# EAGLE design buses (EAGLE 9.6.2)
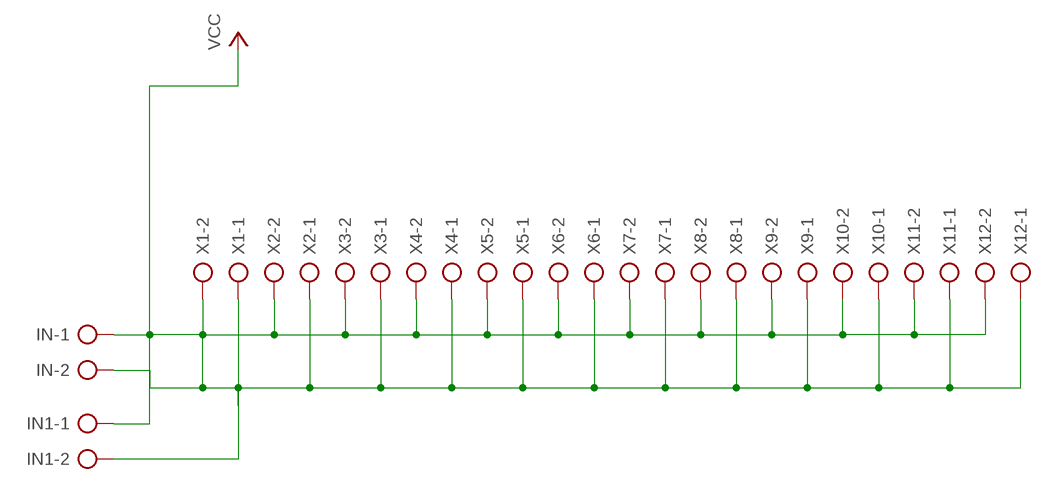
[diagram p0: schematic, sheet 1]

## Parts
IN  AK500/2-H  [AK500/2-H]
IN1  AK500/2-H  [AK500/2-H]
X1  AK500/2-H  [AK500/2-H]
X2  AK500/2-H  [AK500/2-H]
X3  AK500/2-H  [AK500/2-H]
X4  AK500/2-H  [AK500/2-H]
X5  AK500/2-H  [AK500/2-H]
X6  AK500/2-H  [AK500/2-H]
X7  AK500/2-H  [AK500/2-H]
X8  AK500/2-H  [AK500/2-H]
X9  AK500/2-H  [AK500/2-H]
X10  AK500/2-H  [AK500/2-H]
X11  AK500/2-H  [AK500/2-H]
X12  AK500/2-H  [AK500/2-H]

## Nets
VCC: IN1.1 IN1.2 IN.1 IN.2 X1.1 X1.2 X2.1 X2.2 X3.1 X3.2 X4.1 X4.2 X5.1 X5.2 X6.1 X6.2 X7.1 X7.2 X8.1 X8.2 X9.1 X9.2 X10.1 X10.2 X11.1 X11.2 X12.1 X12.2

## Library data of the parts
IN IN1 X1-X12 = con-ptr500:AK500/2-H: CONNECTOR Aug. 2004 / PTR Meßtechnik: Die Bezeichnung der Serie AK505 wurde geändert. Es handelt sich hierbei um AK500 in horizontaler Ausführung.; OC_FARNELL: unknown; OC_NEWARK: unknown

## Board
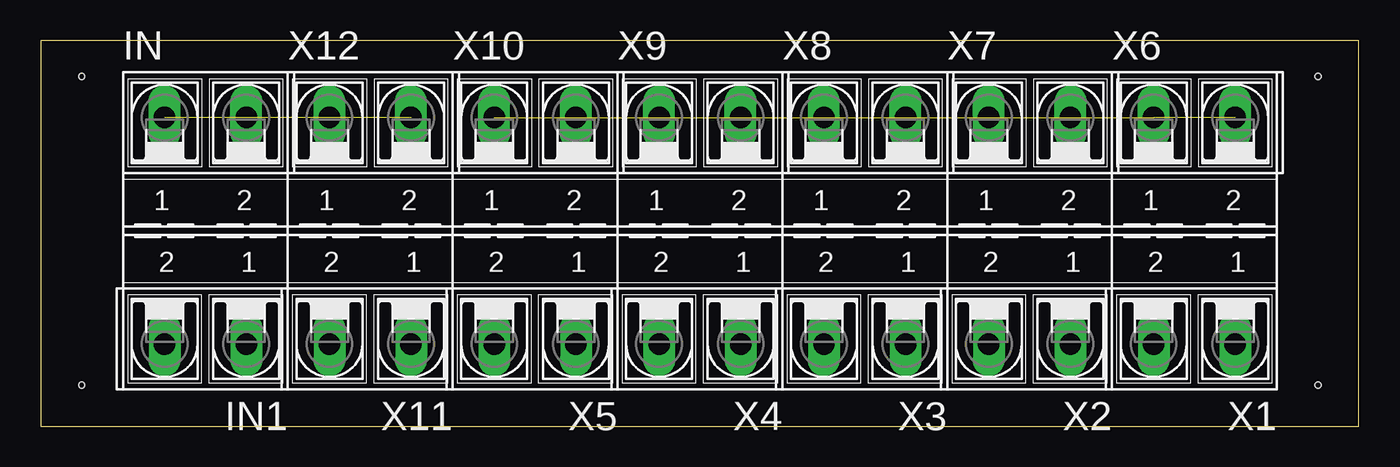
[diagram p1: board, top side]
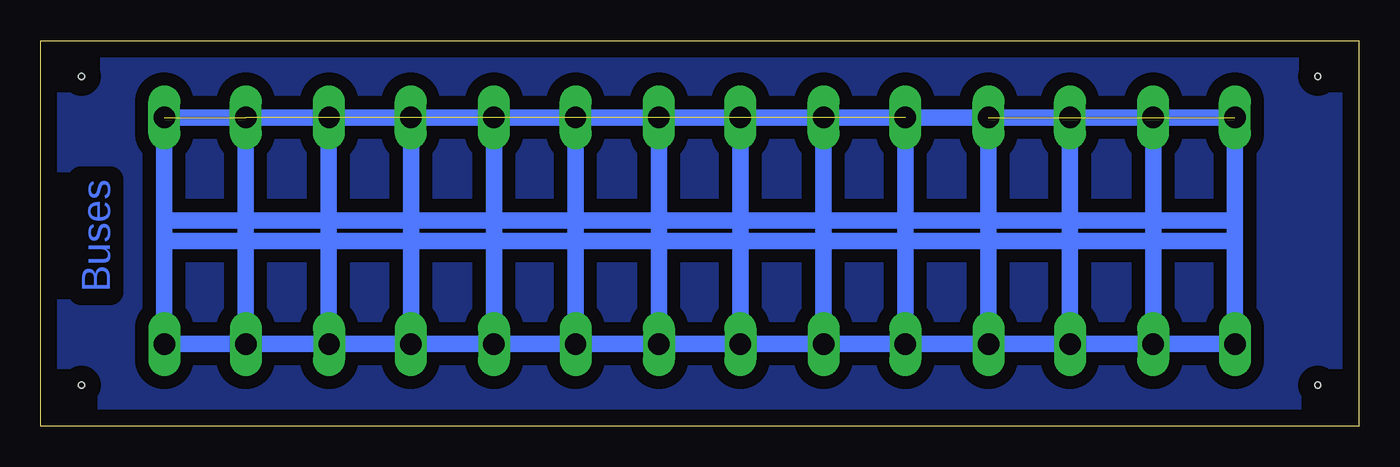
[diagram p2: board, bottom side, seen from below]

Size 81.26 x 23.8 mm. Coordinates in mm from the lower left corner, seen from the top.
Outline: 0,0 81.26,0 81.26,23.8 0,23.8 0,0
Copper layers (1*16): Top 0.035mm / dielectric 1.5mm / Bottom 0.035mm
Design rules "default": minimum track width 6mil, minimum drill 0.35mm, track to track 6mil, track to pad 6mil, pad to pad 6mil, via to via 6mil, smd to smd 6mil, copper to edge 40mil, drill to drill 6mil, minimum pad ring 10mil, minimum via ring 8mil, stop-mask expansion 4mil, vias tented up to drill 0mil, thermal gap 10mil
Holes 0.35 mm at 2.54,21.59 2.54,2.54 78.74,2.54 78.74,21.59

### Footprints (pad centres in the part's own frame; a part is rotated, then mirrored left to right if it is on the bottom)
AK500/2-H = drill 1.321 long: 1 -2.515,0; 2 2.515,0

### Placement (x,y rotation side)
IN  10.16,19.05 0 top
IN1  10.16,5.08 180 top
X1  71.12,5.08 180 top
X2  60.96,5.08 180 top
X3  50.8,5.08 180 top
X4  40.64,5.08 180 top
X5  30.48,5.08 180 top
X6  71.12,19.05 0 top
X7  60.96,19.05 0 top
X8  50.8,19.05 0 top
X9  40.64,19.05 0 top
X10  30.48,19.05 0 top
X11  20.32,5.08 180 top
X12  20.32,19.05 0 top

### Tracks (layer width: path | path; a pad name or v marks a point on that pad's centre or on a via)
F
  pour Bottom (isolate 0.813): 0,24.13 0,0 81.28,0 81.28,24.13
VCC  (13 unrouted)
  Bottom 0.813: 22.84,7.62 X11.1 | X5.1 32.99,5.11
  Bottom 1.016: 7.65,12.7 IN.1 17.78,19.05 | 7.65,12.7 7.65,11.43 | 7.65,11.43 IN1.2 X1.1 73.64,11.43 | IN1.1 12.68,19.03 12.7,19.05 | 17.78,19.05 22.86,19.05 | 22.86,19.05 27.94,19.05 | 27.94,19.05 33.02,19.05 | 33.02,19.05 38.1,19.05 | 38.1,19.05 43.18,19.05 | 43.18,19.05 48.26,19.05 | 48.26,19.05 53.34,19.05 | 53.34,19.05 58.42,19.05 | 58.42,19.05 63.5,19.05 | 63.5,19.05 68.58,19.05 | 68.58,19.05 X6.2 73.64,12.7 | 73.64,11.43 73.64,12.7 | X1.2 68.61,19.03 68.58,19.05 | X2.1 63.5,5.11 63.5,19.05 | X2.2 58.42,5.11 58.42,19.05 | X3.1 53.31,19.03 53.34,19.05 | X3.2 48.28,19.03 48.26,19.05 | X4.1 43.16,19.03 43.18,19.05 | X4.2 38.12,19.03 38.1,19.05 | X5.1 32.99,19.03 33.02,19.05 | X5.2 27.96,19.03 27.94,19.05 | X11.1 22.84,17.75 22.86,17.78 22.86,19.05 | X11.2 17.8,19.03 17.78,19.05 | 7.65,11.43 73.64,11.43 | 7.65,12.7 73.64,12.7

### Text on the board
Bottom: Buses